# Altium schematic sheet LCD.SchDoc: LCD
size A4; ApprovedBy: Muhammet YILDIZ; CheckedBy: Muhammet YILDIZ; Author: Muhammet YILDIZ; CompanyName: YıLDıZ IoT; DrawnBy: Muhammet YILDIZ; Engineer: Muhammet YILDIZ; Organization: YıLDıZ IoT; Address1: Elperek Mahallesi; Address2: Saray Sokak No:12; Address3: SAKARYA / TURKEY; Revision: 1; SheetNumber: 5; SheetTotal: 5; SheetSize: A4
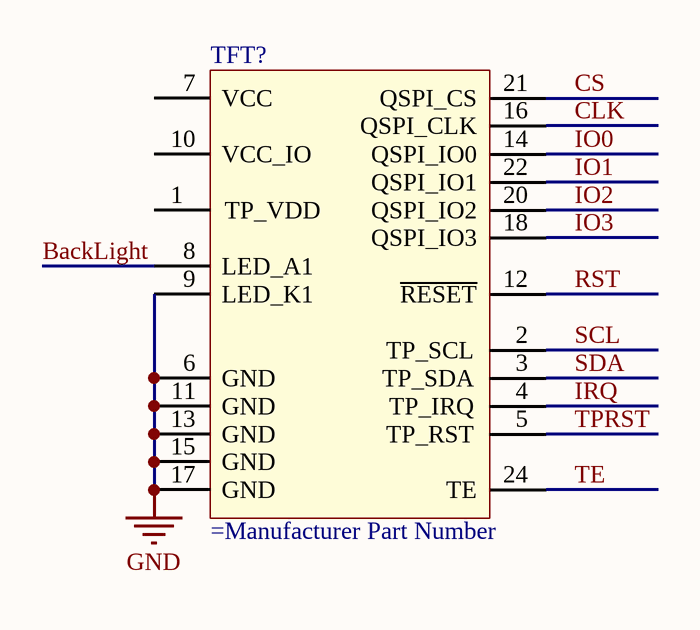
[diagram p0: LCD.SchDoc]

## Parts
TFT?  (no value)  [EASTRISE ER-TFT1.32-1]

## Nets
GND: TFT?.6(GND) TFT?.9(LED_K1) TFT?.11(GND) TFT?.13(GND) TFT?.15(GND) TFT?.17(GND)
BackLight: TFT?.8(LED_A1)
CLK: TFT?.16(QSPI_CLK)
CS: TFT?.21(QSPI_CS)
IO0: TFT?.14(QSPI_IO0)
IO1: TFT?.22(QSPI_IO1)
IO2: TFT?.20(QSPI_IO2)
IO3: TFT?.18(QSPI_IO3)
IRQ: TFT?.4(TP_IRQ)
RST: TFT?.12(~{RESET})
SCL: TFT?.2(TP_SCL)
SDA: TFT?.3(TP_SDA)
TE: TFT?.24(TE)
TPRST: TFT?.5(TP_RST)

Not connected (* = marked no-connect by the designer): TFT? 1(TP_VDD) 7(VCC) 10(VCC_IO)

## Notes on the sheet
- Title:
- Size:
- Project:
- Revision:
- Sheet
- of
- Date:
- YıLDıZ IoT
- Elperek Mahallesi
- Saray Sokak, No:12
- SAKARYA / TURKEY
- File:

## Library data of the parts
TFT? = EASTRISE ER-TFT1.32-1: ER-TFT1.32-1 TFT LCD Display Datasheet